# Altium project LM_HTR_001_Rev_C1.PrjPcb (part 2 of 2)

## Sheet HTR_Bridge2.SchDoc
size Tabloid
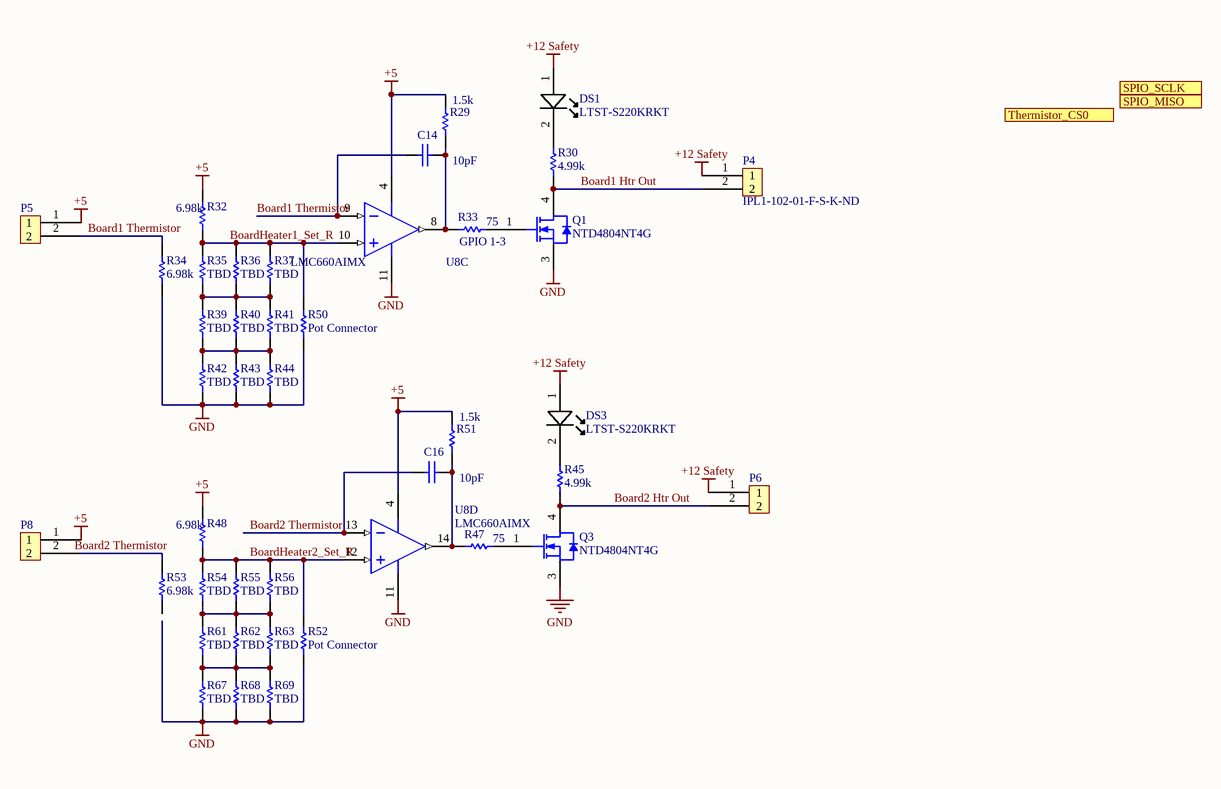
[diagram p3: HTR_Bridge2.SchDoc]

### Parts
(Parts that share a designator on the sheet are numbered #1, #2 ... from top to bottom, then left to right.)
C14#2  Capacitance: 10pF  [CAPC0805(2012)145_N]  (hidden comment: CAP CER 0.1UF 25V X7R 0805)
C16  Capacitance: 10pF  [CAPC0805(2012)145_N]  (hidden comment: CAP CER 0.1UF 25V X7R 0805)
DS1#2  Manufacturer Part Number: LTST-S220KRKT  [0805C_L]  (hidden comment: Visible Name Value Type    False Description Lite-On LTST-S220KRKT Red LED, 631 nm 2012 (0805) Side View, Rectangle Lens SMD package STRING)
DS3#2  Manufacturer Part Number: LTST-S220KRKT  [0805C_L]  (hidden comment: Visible Name Value Type    False Description Lite-On LTST-S220KRKT Red LED, 631 nm 2012 (0805) Side View, Rectangle Lens SMD package STRING)
P4#2  Supplier Part Number 1: IPL1-102-01-F-S-K-ND  [IPL1-102-01-F-S-K]  (hidden comment: IPL1-102-01-F-S-K)
P5#2  IPL1-102-01-F-S-K  [IPL1-102-01-F-S-K]  (value not drawn)
P6#2  IPL1-102-01-F-S-K  [IPL1-102-01-F-S-K]  (value not drawn)
P8#2  IPL1-102-01-F-S-K  [IPL1-102-01-F-S-K]  (value not drawn)
Q1#2  NTD4804NT4G  [ONSC-DPAK-3-369AA-01_V]
Q3#2  NTD4804NT4G  [ONSC-DPAK-3-369AA-01_V]
R29#2  1.5k  [RESC0805(2012)_N]
R30#2  Resistance (Ohms): 4.99k  [RESC0805(2012)_L]
R32#2  Resistance (Ohms): 6.98k  [RESC0805(2012)_N]  (hidden comment: 6K98 1% 0805(2012))
R33#2  Resistance (Ohms): 75  [RESC0805(2012)_L]
R34#2  Resistance (Ohms): 6.98k  [RESC0805(2012)_N]  (hidden comment: 6K98 1% 0805(2012))
R35#2  TBD  [RESC0805(2012)_N]
R36#2  TBD  [RESC0805(2012)_N]
R37#2  TBD  [RESC0805(2012)_N]
R39#2  TBD  [RESC0805(2012)_N]
R40#2  TBD  [RESC0805(2012)_N]
R41#2  TBD  [RESC0805(2012)_N]
R42#2  TBD  [RESC0805(2012)_N]
R43#2  TBD  [RESC0805(2012)_N]
R44#2  TBD  [RESC0805(2012)_N]
R45#2  Resistance (Ohms): 4.99k  [RESC0805(2012)_L]
R47#2  Resistance (Ohms): 75  [RESC0805(2012)_L]
R48#2  Resistance (Ohms): 6.98k  [RESC0805(2012)_N]  (hidden comment: 6K98 1% 0805(2012))
R50  Pot Connector  [AXIAL-0.3]
R51  1.5k  [RESC0805(2012)_N]
R52  Pot Connector  [AXIAL-0.3]
R53#2  Resistance (Ohms): 6.98k  [RESC0805(2012)_N]  (hidden comment: 6K98 1% 0805(2012))
R54#2  TBD  [RESC0805(2012)_N]
R55#2  TBD  [RESC0805(2012)_N]
R56#2  TBD  [RESC0805(2012)_N]
R61#2  TBD  [RESC0805(2012)_N]
R62#2  TBD  [RESC0805(2012)_N]
R63#2  TBD  [RESC0805(2012)_N]
R67#2  TBD  [RESC0805(2012)_N]
R68#2  TBD  [RESC0805(2012)_N]
R69#2  TBD  [RESC0805(2012)_N]
U8#1  LMC660AIMX  [D0014A_N]  (parts C,D of 4)

### Ports
SPIO_MISO, SPIO_SCLK, Thermistor_CS0

### Nets
+5: P5#2.1 P8#2.1 R29#2.2 R32#2.2 R48#2.2 R51.2 U8#1.4(V+)
+12 Safety: DS1#2.1(A) DS3#2.1(A) P4#2.1 P6#2.1
GND: Q1#2.3(S) Q3#2.3(S) R34#2.1 R42#2.1 R43#2.1 R44#2.1 R50.1 R52.1 R67#2.1 R68#2.1 R69#2.1 U8#1.11(V-)
Board1 Htr Out: P4#2.2 Q1#2.4(D) R30#2.2
Board1 Thermistor: C14#2.1 P5#2.2 R34#2.2 U8#1.9(IN3-)
Board2 Htr Out: P6#2.2 Q3#2.4(D) R45#2.2
Board2 Thermistor: C16.1 U8#1.13(IN4-)
BoardHeater1_Set_R: R32#2.1 R35#2.2 R36#2.2 R37#2.2 R50.2 U8#1.10(IN3+)
BoardHeater2_Set_R: R48#2.1 R52.2 R54#2.2 R55#2.2 R56#2.2 U8#1.12(IN4+)
NetC14#2_2: C14#2.2 R29#2.1 R33#2.1 U8#1.8(OUT3)
NetC16_2: C16.2 R47#2.1 R51.1 U8#1.14(OUT4)
NetDS1#2_2: DS1#2.2(K) R30#2.1
NetDS3#2_2: DS3#2.2(K) R45#2.1
NetP8#2_2: P8#2.2 R53#2.2
NetQ1#2_1: Q1#2.1(G) R33#2.2
NetQ3#2_1: Q3#2.1(G) R47#2.2
NetR35#2_1: R35#2.1 R36#2.1 R37#2.1 R39#2.2 R40#2.2 R41#2.2
NetR39#2_1: R39#2.1 R40#2.1 R41#2.1 R42#2.2 R43#2.2 R44#2.2
NetR54#2_1: R54#2.1 R55#2.1 R56#2.1 R61#2.2 R62#2.2 R63#2.2
NetR61#2_1: R61#2.1 R62#2.1 R63#2.1 R67#2.2 R68#2.2 R69#2.2

Not connected (* = marked no-connect by the designer): R53#2 1

### Notes on the sheet
- (near R33#2) GPIO 1-3
- Labels drawn without touching a wire or pin: Board2 Thermistor
- Title
- Size:
- Date:
- Tabloid
- Number:
- Time:
- Revision:
- Sheet
- of
- ZLS Corporation
- 7801 North Lamar Blvd.
- Suite E-184
- Austin, Texas 78752  USA
- (512) 453-0288
- File:

### Library data of the parts
C14#2 C16 = CMP-1036-04795-1: Manufacturer: Murata Electronics North America; Manufacturer Part Number: GRM21BR71E104KA01L; Tolerance: ±10%; Supplier 1: Digi-Key; Supplier Part Number 1: 490-1673-6-ND; RoHS: RoHS Compliant; Category: Capacitors; Stock 1: 891652; Pricing 1: 1=0.2, 10=0.145, 100=0.0683, 500=0.04788, 1000=0.03964 (USD); Packaging: Digi-Reel®; Part Status: Active; Voltage - Rated: 25V; Temperature Coefficient: X7R; Operating Temperature: -55°C ~ 125°C; Features: -; Ratings: -; Applications: General Purpose; Mounting Type: Surface Mount, MLCC; Package / Case: 0805 (2012 Metric); Size / Dimension: 0.079" L x 0.049" W (2.00mm x 1.25mm); Height - Seated (Max): -; Thickness (Max): 0.053" (1.35mm); Lead Spacing: -; Lead Style: -; ComponentLink1URL: http://www.murata.com/~/media/webrenewal/support/library/catalog/products/capacitor/mlcc/c02e.ashx; ComponentLink1Description: http://www.murata.com/~/media/webrenewal/support/library/catalog/products/capacitor/mlcc/c02e.ashx
DS1#2 DS3#2 = LED A/K: Manufacturer: Vishay / Lite-On; Lens Colour: Colorless; Lens Style: Diffused,Colorless; Viewing Angle: 130°; Luminous Intensity: 54mcd; Forward Current: 20mA; Forward Voltage: 2V; Power Rating: 75mW; Dominant Wavelength: 631nm; Lens Transparency: Clear; Number of Elements: 1; Wavelength: 639nm; Supplier 1: Digi-Key; Supplier Part Number 1: 160-1469-1-ND; Stock 1: 108191; Pricing 1: 1=0.31, 10=0.225, 25=0.1656, 100=0.1183, 250=0.0804, 500=0.071, 1000=0.0556 (USD); Mount: Surface Mount; Case/Package: 0805; Number of Pins: 2; Colour: Red; Case Code (Metric): 2012; Case Code (Imperial): 0805; Min Operating Temperature: -55°C; Max Operating Temperature: 85°C; Packaging: Tape and Reel; Package Quantity: 4000; Illumination Colour: Red; Test Current: 20mA; Power Dissipation: 75mW; Number of LEDs: 1; Length: 2.1mm; Height: 0.6mm; Width: 1mm; Depth: 0.6mm; Radiation Hardening: No; Lead Free: Lead Free; ComponentLink1URL: https://datasheet.ciiva.com/2110/s-110-ltst-s220krkt-2110132.pdf; ComponentLink1Description: https://datasheet.ciiva.com/2110/s-110-ltst-s220krkt-2110132.pdf; ComponentLink2URL: https://datasheet.ciiva.com/2110/s-110-ltst-s220krkt-2110133.pdf; ComponentLink2Description: https://datasheet.ciiva.com/2110/s-110-ltst-s220krkt-2110133.pdf; ComponentLink3URL: https://datasheet.ciiva.com/2110/s-110-ltst-s220krkt-2110134.pdf; ComponentLink3Description: https://datasheet.ciiva.com/2110/s-110-ltst-s220krkt-2110134.pdf; ComponentLink4URL: https://datasheet.ciiva.com/12403/lite-on-ltst-s220krkt-187389-12403798.pdf; ComponentLink4Description: https://datasheet.ciiva.com/12403/lite-on-ltst-s220krkt-187389-12403798.pdf; ComponentLink5URL: https://datasheet.ciiva.com/16345/lite-onltst-s220krkt-16345511.pdf; ComponentLink5Description: https://datasheet.ciiva.com/16345/lite-onltst-s220krkt-16345511.pdf; ComponentLink6URL: https://datasheet.ciiva.com/15118/getdatasheetpartid-225752-15118120.pdf; ComponentLink6Description: https://datasheet.ciiva.com/15118/getdatasheetpartid-225752-15118120.pdf; ComponentLink7URL: https://datasheet.ciiva.com/14633/0900766b80dc0b76-14633737.pdf; ComponentLink7Description: https://datasheet.ciiva.com/14633/0900766b80dc0b76-14633737.pdf; ComponentLink8URL: https://datasheet.ciiva.com/11775/0900766b80dc0b76-11775439.pdf; ComponentLink8Description: https://datasheet.ciiva.com/11775/0900766b80dc0b76-11775439.pdf
P4#2 P5#2 P6#2 P8#2 = IPL1-102-01-F-S-K: .100 TERMINAL ASSEMBLY; Manufacturer: Samtec Inc.; Connector Type: Header; Pitch - Mating: 0.100" (2.54mm); Number of Positions: 2; Number of Positions Loaded: All; Style: Board to Cable/Wire; Shrouding: Shrouded - 4 Wall; Contact Length - Mating: 0.215" (5.46mm); Contact Length - Post: 0.120" (3.05mm); Material Flammability Rating: UL94 V-0; Voltage Rating: 675VAC, 954VDC; Supplier 1: Digi-Key; Manufacturer Part Number: IPL1-102-01-F-S-K; RoHS: RoHS Compliant; Category: Connectors, Interconnects; Stock 1: 0; Pricing 1: 1=1.69 (USD); Packaging: Tube; Part Status: Active; Contact Type: Male Pin; Number of Rows: 1; Row Spacing - Mating: -; Mounting Type: Through Hole; Termination: Solder; Fastening Type: Locking Ramp; Overall Contact Length: -; Insulation Height: 0.320" (8.13mm); Contact Shape: Square; Contact Finish - Mating: Gold; Contact Finish Thickness - Mating: 3µin (0.08µm); Contact Finish - Post: Tin; Contact Material: Phosphor Bronze; Insulation Material: Liquid Crystal Polymer (LCP); Features: -; Operating Temperature: -55°C ~ 125°C; Ingress Protection: -; Insulation Color: Natural; Current Rating: -; Mated Stacking Heights: -; Contact Finish Thickness - Post: -; Applications: -; ComponentLink1URL: http://suddendocs.samtec.com/prints/ipl1-1xx-xx-xxx-s-xx-x-xx-mkt.pdf; ComponentLink1Description: http://suddendocs.samtec.com/prints/ipl1-1xx-xx-xxx-s-xx-x-xx-mkt.pdf
  P5#2 P6#2 P8#2: Supplier Part Number 1: IPL1-102-01-F-S-K-ND
Q1#2 Q3#2 = CMP-1058-00341-1: Power MOSFET, 30 V, 117 A, Single N-Channel, 3-Pin DPAK, Pb-Free, Tape and Reel; Manufacturer: On Semiconductor; Coss Typ (pF): 952; Qrr Typ (nC): 30; VGS Max (V): 20; ID Max (A): 117; Crss Typ (pF): 556; Channel Polarity: N Channel; Ciss Typ (pF): 4490; VGS(th) Max (V): 2.5; ComponentLink2Description: Datasheet; ComponentLink3Description: Package Specification; Mounting Technology: Surface Mount; PackageDescription: 3-Pin Flange Mount, Body 6.54 x 6.095 mm, Pitch 2.29 mm; PackageVersion: Rev. B, 06/2010; PartNumber: NTD4804NT4G; ComponentLink2URL: http://www.onsemi.cn/pub_link/Collateral/NTD4804N-D.PDF; RoHS: Pb-Free; Configuration: Single; DatasheetVersion: Rev. 8; PackageReference: DPAK-3-369AA-01; ComponentLink3URL: http://www.onsemi.cn/pub_link/Collateral/369AA.PDF; ComponentLink1Description: Manufacturer URL; Packing: Tape and Reel; Package Type: DPAK-3; ComponentLink1URL: http://www.onsemi.com/; V(BR)DSS Min (V): 30; Supplier 1: Digi-Key; Supplier Part Number 1: NTD4804NT4GOSDKR-ND
R29#2 R51 = CMP-1013-00606-1: 6K98 0.125W 1% 0805 (2012 Metric)  SMD
R30#2 R45#2 = CMP-1013-00393-1: Manufacturer: Vishay Dale; Manufacturer Part Number: CRCW08054K99FKEA; Tolerance: ±1%; Power (Watts): 0.125W, 1/8W; Temperature Coefficient: ±100ppm/°C; Supplier 1: Digi-Key; Supplier Part Number 1: 541-4.99KCCT-ND; RoHS: RoHS Compliant; Category: Resistors; Stock 1: 93740; Pricing 1: 1=0.1, 10=0.044, 100=0.0178, 1000=0.00802, 2500=0.00696 (USD); Packaging: Cut Tape (CT); Part Status: Active; Composition: Thick Film; Features: Automotive AEC-Q200; Operating Temperature: -55°C ~ 155°C; Package / Case: 0805 (2012 Metric); Supplier Device Package: 0805; Size / Dimension: 0.079" L x 0.049" W (2.00mm x 1.25mm); Height - Seated (Max): 0.020" (0.50mm); Failure Rate: -; ComponentLink1URL: http://www.vishay.com/docs/20035/dcrcwe3.pdf; ComponentLink1Description: http://www.vishay.com/docs/20035/dcrcwe3.pdf
R32#2 R34#2 R48#2 R53#2 = CMP-1013-00606-1: 6K98 0.125W 1% 0805 (2012 Metric)  SMD; Manufacturer: Vishay Dale; Manufacturer Part Number: CRCW08056K98FKEA; Power (Watts): 0.125W, 1/8W; Temperature Coefficient: ±100ppm/°C; Supplier 1: Digi-Key; Supplier Part Number 1: 541-6.98KCCT-ND; RoHS: RoHS Compliant; Category: Resistors; Stock 1: 34245; Pricing 1: 1=0.1, 10=0.044, 100=0.0178, 1000=0.00802, 2500=0.00696 (USD); Packaging: Cut Tape (CT); Part Status: Active; Tolerance: ±1%; Composition: Thick Film; Features: Automotive AEC-Q200; Operating Temperature: -55°C ~ 155°C; Package / Case: 0805 (2012 Metric); Supplier Device Package: 0805; Size / Dimension: 0.079" L x 0.049" W (2.00mm x 1.25mm); Height - Seated (Max): 0.020" (0.50mm); Failure Rate: -; ComponentLink1URL: http://www.vishay.com/docs/20035/dcrcwe3.pdf; ComponentLink1Description: http://www.vishay.com/docs/20035/dcrcwe3.pdf
R33#2 R47#2 = CMP-1013-00393-1: Manufacturer: Vishay Dale; Manufacturer Part Number: CRCW080575R0FKEA; Tolerance: ±1%; Power (Watts): 0.125W, 1/8W; Temperature Coefficient: ±100ppm/°C; Supplier 1: Digi-Key; Supplier Part Number 1: 541-75.0CCT-ND; RoHS: RoHS Compliant; Category: Resistors; Stock 1: 32546; Pricing 1: 1=0.1, 10=0.044, 100=0.0178, 1000=0.00802, 2500=0.00696 (USD); Packaging: Cut Tape (CT); Part Status: Active; Composition: Thick Film; Features: Automotive AEC-Q200; Operating Temperature: -55°C ~ 155°C; Package / Case: 0805 (2012 Metric); Supplier Device Package: 0805; Size / Dimension: 0.079" L x 0.049" W (2.00mm x 1.25mm); Height - Seated (Max): 0.020" (0.50mm); Failure Rate: -; ComponentLink1URL: http://www.vishay.com/docs/20035/dcrcwe3.pdf; ComponentLink1Description: http://www.vishay.com/docs/20035/dcrcwe3.pdf
R35#2 R36#2 R37#2 R39#2 R40#2 R41#2 R42#2 R43#2 R44#2 R54#2 R55#2 R56#2 R61#2 R62#2 R63#2 R67#2 R68#2 R69#2 = CMP-1013-00606-1: 6K98 0.125W 1% 0805 (2012 Metric)  SMD; Manufacturer: Vishay Dale; Power (Watts): 0.125W, 1/8W; Temperature Coefficient: ±100ppm/°C; Supplier 1: Digi-Key; RoHS: RoHS Compliant; Category: Resistors; Stock 1: 34245; Pricing 1: 1=0.1, 10=0.044, 100=0.0178, 1000=0.00802, 2500=0.00696 (USD); Packaging: Cut Tape (CT); Part Status: Active; Resistance (Ohms): TBD; Tolerance: ±1%; Composition: Thick Film; Features: Automotive AEC-Q200; Operating Temperature: -55°C ~ 155°C; Package / Case: 0805 (2012 Metric); Supplier Device Package: 0805; Size / Dimension: 0.079" L x 0.049" W (2.00mm x 1.25mm); Height - Seated (Max): 0.020" (0.50mm); Failure Rate: -; ComponentLink1URL: http://www.vishay.com/docs/20035/dcrcwe3.pdf; ComponentLink1Description: http://www.vishay.com/docs/20035/dcrcwe3.pdf
R50 R52 = Res1: Resistor
U8#1 = CMP-0055-00899-3: CMOS Quad Operational Amplifier, 14-pin Narrow SOIC; Manufacturer: Texas Instruments; PackageTopMarking: NSUZXYTTE#*LMC660AIM; PowerWise: N; CompType: Amplifiers; RoHS: N; Code_JEDEC: MS-012AB; ComponentLink1Description: Datasheet URL; ComponentLink1URL: http://www.ti.com/general/docs/lit/getliterature.tsp?genericPartNumber=LMC660&fileType=pdf; Code_IPC: SOIC127P600-14; PackageDescription: Molded Package S.O., .150in Wide, 14 Lead; Package Reference: D0014A; PinCount: 14; PartId: 1

## Sheet HTR_Bridge3.SchDoc
size Tabloid
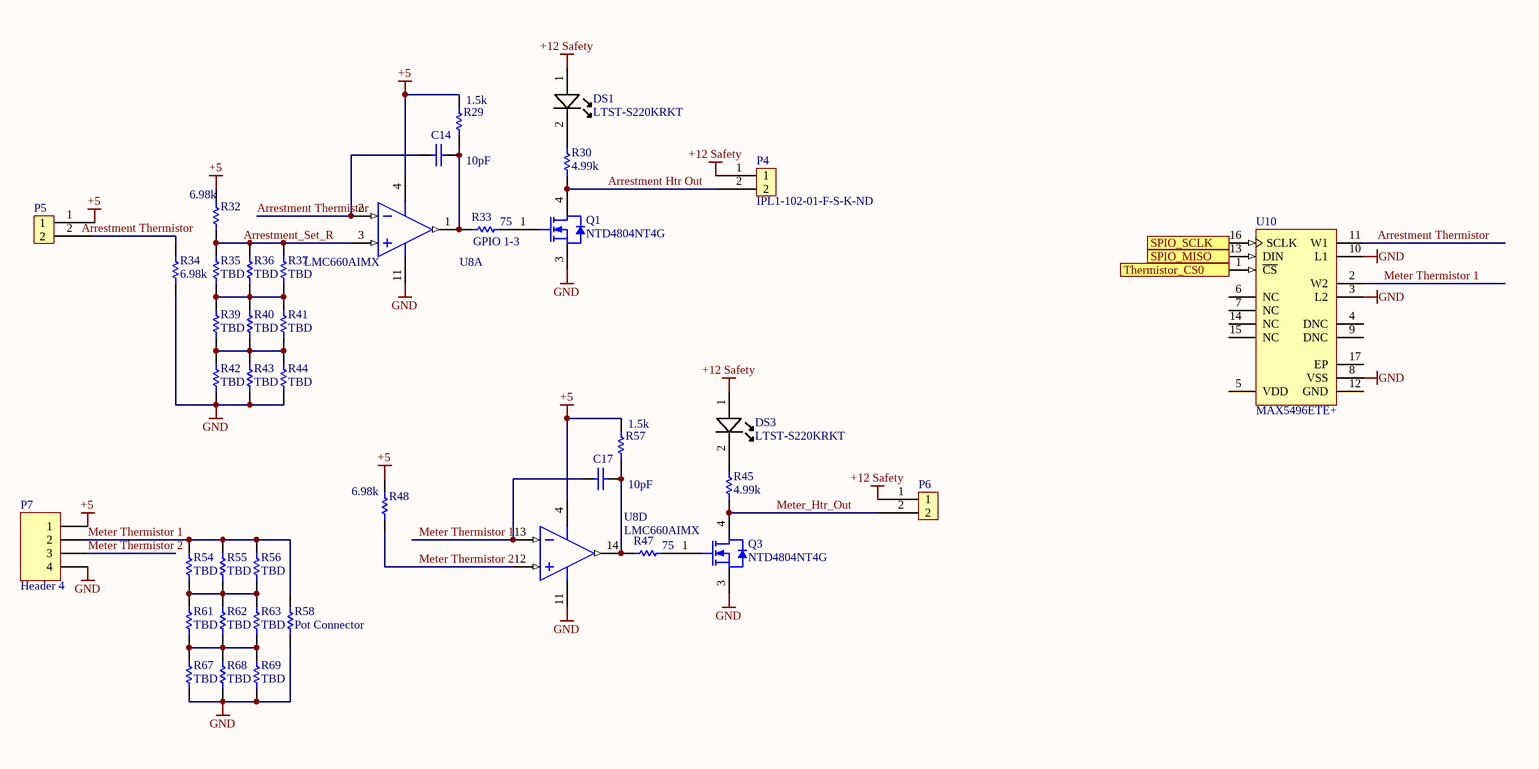
[diagram p4: HTR_Bridge3.SchDoc]

### Parts
(Parts that share a designator on the sheet are numbered #1, #2 ... from top to bottom, then left to right.)
C14#3  Capacitance: 10pF  [CAPC0805(2012)145_N]  (hidden comment: CAP CER 0.1UF 25V X7R 0805)
C17  Capacitance: 10pF  [CAPC0805(2012)145_N]  (hidden comment: CAP CER 0.1UF 25V X7R 0805)
DS1#3  Manufacturer Part Number: LTST-S220KRKT  [0805C_L]  (hidden comment: Visible Name Value Type    False Description Lite-On LTST-S220KRKT Red LED, 631 nm 2012 (0805) Side View, Rectangle Lens SMD package STRING)
DS3#3  Manufacturer Part Number: LTST-S220KRKT  [0805C_L]  (hidden comment: Visible Name Value Type    False Description Lite-On LTST-S220KRKT Red LED, 631 nm 2012 (0805) Side View, Rectangle Lens SMD package STRING)
P4#3  Supplier Part Number 1: IPL1-102-01-F-S-K-ND  [IPL1-102-01-F-S-K]  (hidden comment: IPL1-102-01-F-S-K)
P5#3  IPL1-102-01-F-S-K  [IPL1-102-01-F-S-K]  (value not drawn)
P6#3  IPL1-102-01-F-S-K  [IPL1-102-01-F-S-K]  (value not drawn)
P7  Header 4  [IPL1-104-01-L-S-K]
Q1#3  NTD4804NT4G  [ONSC-DPAK-3-369AA-01_V]
Q3#3  NTD4804NT4G  [ONSC-DPAK-3-369AA-01_V]
R29#3  1.5k  [RESC0805(2012)_N]
R30#3  Resistance (Ohms): 4.99k  [RESC0805(2012)_L]
R32#3  Resistance (Ohms): 6.98k  [RESC0805(2012)_N]  (hidden comment: 6K98 1% 0805(2012))
R33#3  Resistance (Ohms): 75  [RESC0805(2012)_L]
R34#3  Resistance (Ohms): 6.98k  [RESC0805(2012)_N]  (hidden comment: 6K98 1% 0805(2012))
R35#3  TBD  [RESC0805(2012)_N]
R36#3  TBD  [RESC0805(2012)_N]
R37#3  TBD  [RESC0805(2012)_N]
R39#3  TBD  [RESC0805(2012)_N]
R40#3  TBD  [RESC0805(2012)_N]
R41#3  TBD  [RESC0805(2012)_N]
R42#3  TBD  [RESC0805(2012)_N]
R43#3  TBD  [RESC0805(2012)_N]
R44#3  TBD  [RESC0805(2012)_N]
R45#3  Resistance (Ohms): 4.99k  [RESC0805(2012)_L]
R47#3  Resistance (Ohms): 75  [RESC0805(2012)_L]
R48#3  Resistance (Ohms): 6.98k  [RESC0805(2012)_N]  (hidden comment: 6K98 1% 0805(2012))
R54#3  TBD  [RESC0805(2012)_N]
R55#3  TBD  [RESC0805(2012)_N]
R56#3  TBD  [RESC0805(2012)_N]
R57  1.5k  [RESC0805(2012)_N]
R58  Pot Connector  [AXIAL-0.3]
R61#3  TBD  [RESC0805(2012)_N]
R62#3  TBD  [RESC0805(2012)_N]
R63#3  TBD  [RESC0805(2012)_N]
R67#3  TBD  [RESC0805(2012)_N]
R68#3  TBD  [RESC0805(2012)_N]
R69#3  TBD  [RESC0805(2012)_N]
U8#2  LMC660AIMX  [D0014A_N]  (parts A,D of 4)
U10  MAX5496ETE+  [MAXM-T1655+3_M]

### Ports
SPIO_MISO, SPIO_SCLK, Thermistor_CS0

### Nets
+5: P5#3.1 P7.1 R29#3.2 R32#3.2 R48#3.2 R57.2 U8#2.4(V+)
+12 Safety: DS1#3.1(A) DS3#3.1(A) P4#3.1 P6#3.1
GND: P7.4 Q1#3.3(S) Q3#3.3(S) R34#3.1 R42#3.1 R43#3.1 R44#3.1 R58.1 R67#3.1 R68#3.1 R69#3.1 U8#2.11(V-) U10.3(L2) U10.8(VSS) U10.10(L1)
Arrestment Htr Out: P4#3.2 Q1#3.4(D) R30#3.2
Arrestment Thermistor: C14#3.1 U8#2.2(IN1-) U10.11(W1)
Arrestment_Set_R: R32#3.1 R35#3.2 R36#3.2 R37#3.2 U8#2.3(IN1+)
Meter Thermistor 1: C17.1 P7.2 R54#3.2 R55#3.2 R56#3.2 R58.2 U8#2.13(IN4-) U10.2(W2)
Meter Thermistor 2: P7.3 R48#3.1 U8#2.12(IN4+)
Meter_Htr_Out: P6#3.2 Q3#3.4(D) R45#3.2
SPI0_MISO: U10.13(DIN) ; port SPIO_MISO
SPI0_SCLK: U10.16(SCLK) ; port SPIO_SCLK
Thermistor_CS0: U10.1(~{CS}) ; port Thermistor_CS0
NetC14#3_2: C14#3.2 R29#3.1 R33#3.1 U8#2.1(OUT1)
NetC17_2: C17.2 R47#3.1 R57.1 U8#2.14(OUT4)
NetDS1#3_2: DS1#3.2(K) R30#3.1
NetDS3#3_2: DS3#3.2(K) R45#3.1
NetP5#3_2: P5#3.2 R34#3.2
NetQ1#3_1: Q1#3.1(G) R33#3.2
NetQ3#3_1: Q3#3.1(G) R47#3.2
NetR35#3_1: R35#3.1 R36#3.1 R37#3.1 R39#3.2 R40#3.2 R41#3.2
NetR39#3_1: R39#3.1 R40#3.1 R41#3.1 R42#3.2 R43#3.2 R44#3.2
NetR54#3_1: R54#3.1 R55#3.1 R56#3.1 R61#3.2 R62#3.2 R63#3.2
NetR61#3_1: R61#3.1 R62#3.1 R63#3.1 R67#3.2 R68#3.2 R69#3.2

Not connected (* = marked no-connect by the designer): U10 4(DNC) 5(VDD) 6(NC) 7(NC) 9(DNC) 12(GND) 14(NC) 15(NC) 17(EP)

### Notes on the sheet
- (near R33#3) GPIO 1-3
- Labels drawn without touching a wire or pin: Arrestment Thermistor
- Title
- Size:
- Date:
- Tabloid
- Number:
- Time:
- Revision:
- Sheet
- of
- ZLS Corporation
- 7801 North Lamar Blvd.
- Suite E-184
- Austin, Texas 78752  USA
- (512) 453-0288
- File:

### Library data of the parts
C14#3 C17 = CMP-1036-04795-1: as C14#2 on sheet HTR_Bridge2; Supplier 1: Digi-Key; Supplier Part Number 1: 490-1673-6-ND; RoHS: RoHS Compliant; Category: Capacitors; Stock 1: 891652; Pricing 1: 1=0.2, 10=0.145, 100=0.0683, 500=0.04788, 1000=0.03964 (USD); Packaging: Digi-Reel®; Part Status: Active; Voltage - Rated: 25V; Temperature Coefficient: X7R; Operating Temperature: -55°C ~ 125°C; Features: -; Ratings: -; Applications: General Purpose; Mounting Type: Surface Mount, MLCC; Package / Case: 0805 (2012 Metric); Size / Dimension: 0.079" L x 0.049" W (2.00mm x 1.25mm); Height - Seated (Max): -; Thickness (Max): 0.053" (1.35mm); Lead Spacing: -; Lead Style: -; ComponentLink1URL: http://www.murata.com/~/media/webrenewal/support/library/catalog/products/capacitor/mlcc/c02e.ashx; ComponentLink1Description: http://www.murata.com/~/media/webrenewal/support/library/catalog/products/capacitor/mlcc/c02e.ashx
DS1#3 DS3#3 = LED A/K: as DS1#2 on sheet HTR_Bridge2; Supplier 1: Digi-Key; Supplier Part Number 1: 160-1469-1-ND; Stock 1: 108191; Pricing 1: 1=0.31, 10=0.225, 25=0.1656, 100=0.1183, 250=0.0804, 500=0.071, 1000=0.0556 (USD); Mount: Surface Mount; Case/Package: 0805; Number of Pins: 2; Colour: Red; Case Code (Metric): 2012; Case Code (Imperial): 0805; Min Operating Temperature: -55°C; Max Operating Temperature: 85°C; Packaging: Tape and Reel; Package Quantity: 4000; Illumination Colour: Red; Test Current: 20mA; Power Dissipation: 75mW; Number of LEDs: 1; Length: 2.1mm; Height: 0.6mm; Width: 1mm; Depth: 0.6mm; Radiation Hardening: No; Lead Free: Lead Free; ComponentLink1URL: https://datasheet.ciiva.com/2110/s-110-ltst-s220krkt-2110132.pdf; ComponentLink1Description: https://datasheet.ciiva.com/2110/s-110-ltst-s220krkt-2110132.pdf; ComponentLink2URL: https://datasheet.ciiva.com/2110/s-110-ltst-s220krkt-2110133.pdf; ComponentLink2Description: https://datasheet.ciiva.com/2110/s-110-ltst-s220krkt-2110133.pdf; ComponentLink3URL: https://datasheet.ciiva.com/2110/s-110-ltst-s220krkt-2110134.pdf; ComponentLink3Description: https://datasheet.ciiva.com/2110/s-110-ltst-s220krkt-2110134.pdf; ComponentLink4URL: https://datasheet.ciiva.com/12403/lite-on-ltst-s220krkt-187389-12403798.pdf; ComponentLink4Description: https://datasheet.ciiva.com/12403/lite-on-ltst-s220krkt-187389-12403798.pdf; ComponentLink5URL: https://datasheet.ciiva.com/16345/lite-onltst-s220krkt-16345511.pdf; ComponentLink5Description: https://datasheet.ciiva.com/16345/lite-onltst-s220krkt-16345511.pdf; ComponentLink6URL: https://datasheet.ciiva.com/15118/getdatasheetpartid-225752-15118120.pdf; ComponentLink6Description: https://datasheet.ciiva.com/15118/getdatasheetpartid-225752-15118120.pdf; ComponentLink7URL: https://datasheet.ciiva.com/14633/0900766b80dc0b76-14633737.pdf; ComponentLink7Description: https://datasheet.ciiva.com/14633/0900766b80dc0b76-14633737.pdf; ComponentLink8URL: https://datasheet.ciiva.com/11775/0900766b80dc0b76-11775439.pdf; ComponentLink8Description: https://datasheet.ciiva.com/11775/0900766b80dc0b76-11775439.pdf
P4#3 P5#3 P6#3 = IPL1-102-01-F-S-K: as P4#2 on sheet HTR_Bridge2; Supplier 1: Digi-Key; Manufacturer Part Number: IPL1-102-01-F-S-K; RoHS: RoHS Compliant; Category: Connectors, Interconnects; Stock 1: 0; Pricing 1: 1=1.69 (USD); Packaging: Tube; Part Status: Active; Contact Type: Male Pin; Number of Rows: 1; Row Spacing - Mating: -; Mounting Type: Through Hole; Termination: Solder; Fastening Type: Locking Ramp; Overall Contact Length: -; Insulation Height: 0.320" (8.13mm); Contact Shape: Square; Contact Finish - Mating: Gold; Contact Finish Thickness - Mating: 3µin (0.08µm); Contact Finish - Post: Tin; Contact Material: Phosphor Bronze; Insulation Material: Liquid Crystal Polymer (LCP); Features: -; Operating Temperature: -55°C ~ 125°C; Ingress Protection: -; Insulation Color: Natural; Current Rating: -; Mated Stacking Heights: -; Contact Finish Thickness - Post: -; Applications: -; ComponentLink1URL: http://suddendocs.samtec.com/prints/ipl1-1xx-xx-xxx-s-xx-x-xx-mkt.pdf; ComponentLink1Description: http://suddendocs.samtec.com/prints/ipl1-1xx-xx-xxx-s-xx-x-xx-mkt.pdf
  P5#3 P6#3: Supplier Part Number 1: IPL1-102-01-F-S-K-ND
P7 = Header 4: Header, 4-Pin; LatestRevisionDate: 17-Jul-2002; LatestRevisionNote: Re-released for DXP Platform.; Publisher: Altium Limited
Q1#3 Q3#3 = CMP-1058-00341-1: as Q1#2 on sheet HTR_Bridge2; ComponentLink2Description: Datasheet; ComponentLink3Description: Package Specification; Mounting Technology: Surface Mount; PackageDescription: 3-Pin Flange Mount, Body 6.54 x 6.095 mm, Pitch 2.29 mm; PackageVersion: Rev. B, 06/2010; PartNumber: NTD4804NT4G; ComponentLink2URL: http://www.onsemi.cn/pub_link/Collateral/NTD4804N-D.PDF; RoHS: Pb-Free; Configuration: Single; DatasheetVersion: Rev. 8; PackageReference: DPAK-3-369AA-01; ComponentLink3URL: http://www.onsemi.cn/pub_link/Collateral/369AA.PDF; ComponentLink1Description: Manufacturer URL; Packing: Tape and Reel; Package Type: DPAK-3; ComponentLink1URL: http://www.onsemi.com/; V(BR)DSS Min (V): 30; Supplier 1: Digi-Key; Supplier Part Number 1: NTD4804NT4GOSDKR-ND
R29#3 R57 = CMP-1013-00606-1: 6K98 0.125W 1% 0805 (2012 Metric)  SMD
R30#3 R45#3 = CMP-1013-00393-1: as R30#2 on sheet HTR_Bridge2; Supplier 1: Digi-Key; Supplier Part Number 1: 541-4.99KCCT-ND; RoHS: RoHS Compliant; Category: Resistors; Stock 1: 93740; Pricing 1: 1=0.1, 10=0.044, 100=0.0178, 1000=0.00802, 2500=0.00696 (USD); Packaging: Cut Tape (CT); Part Status: Active; Composition: Thick Film; Features: Automotive AEC-Q200; Operating Temperature: -55°C ~ 155°C; Package / Case: 0805 (2012 Metric); Supplier Device Package: 0805; Size / Dimension: 0.079" L x 0.049" W (2.00mm x 1.25mm); Height - Seated (Max): 0.020" (0.50mm); Failure Rate: -; ComponentLink1URL: http://www.vishay.com/docs/20035/dcrcwe3.pdf; ComponentLink1Description: http://www.vishay.com/docs/20035/dcrcwe3.pdf
R32#3 R34#3 R48#3 = CMP-1013-00606-1: as R32#2 on sheet HTR_Bridge2; Supplier 1: Digi-Key; Supplier Part Number 1: 541-6.98KCCT-ND; RoHS: RoHS Compliant; Category: Resistors; Stock 1: 34245; Pricing 1: 1=0.1, 10=0.044, 100=0.0178, 1000=0.00802, 2500=0.00696 (USD); Packaging: Cut Tape (CT); Part Status: Active; Tolerance: ±1%; Composition: Thick Film; Features: Automotive AEC-Q200; Operating Temperature: -55°C ~ 155°C; Package / Case: 0805 (2012 Metric); Supplier Device Package: 0805; Size / Dimension: 0.079" L x 0.049" W (2.00mm x 1.25mm); Height - Seated (Max): 0.020" (0.50mm); Failure Rate: -; ComponentLink1URL: http://www.vishay.com/docs/20035/dcrcwe3.pdf; ComponentLink1Description: http://www.vishay.com/docs/20035/dcrcwe3.pdf
R33#3 R47#3 = CMP-1013-00393-1: as R33#2 on sheet HTR_Bridge2; Supplier 1: Digi-Key; Supplier Part Number 1: 541-75.0CCT-ND; RoHS: RoHS Compliant; Category: Resistors; Stock 1: 32546; Pricing 1: 1=0.1, 10=0.044, 100=0.0178, 1000=0.00802, 2500=0.00696 (USD); Packaging: Cut Tape (CT); Part Status: Active; Composition: Thick Film; Features: Automotive AEC-Q200; Operating Temperature: -55°C ~ 155°C; Package / Case: 0805 (2012 Metric); Supplier Device Package: 0805; Size / Dimension: 0.079" L x 0.049" W (2.00mm x 1.25mm); Height - Seated (Max): 0.020" (0.50mm); Failure Rate: -; ComponentLink1URL: http://www.vishay.com/docs/20035/dcrcwe3.pdf; ComponentLink1Description: http://www.vishay.com/docs/20035/dcrcwe3.pdf
R35#3 R36#3 R37#3 R39#3 R40#3 R41#3 R42#3 R43#3 R44#3 R54#3 R55#3 R56#3 R61#3 R62#3 R63#3 R67#3 R68#3 R69#3 = CMP-1013-00606-1: as R35#2 on sheet HTR_Bridge2; Supplier 1: Digi-Key; RoHS: RoHS Compliant; Category: Resistors; Stock 1: 34245; Pricing 1: 1=0.1, 10=0.044, 100=0.0178, 1000=0.00802, 2500=0.00696 (USD); Packaging: Cut Tape (CT); Part Status: Active; Resistance (Ohms): TBD; Tolerance: ±1%; Composition: Thick Film; Features: Automotive AEC-Q200; Operating Temperature: -55°C ~ 155°C; Package / Case: 0805 (2012 Metric); Supplier Device Package: 0805; Size / Dimension: 0.079" L x 0.049" W (2.00mm x 1.25mm); Height - Seated (Max): 0.020" (0.50mm); Failure Rate: -; ComponentLink1URL: http://www.vishay.com/docs/20035/dcrcwe3.pdf; ComponentLink1Description: http://www.vishay.com/docs/20035/dcrcwe3.pdf
R58 = Res1: Resistor
U8#2 = CMP-0055-00899-3: as U8#1 on sheet HTR_Bridge2; RoHS: N; Code_JEDEC: MS-012AB; ComponentLink1Description: Datasheet URL; ComponentLink1URL: http://www.ti.com/general/docs/lit/getliterature.tsp?genericPartNumber=LMC660&fileType=pdf; Code_IPC: SOIC127P600-14; PackageDescription: Molded Package S.O., .150in Wide, 14 Lead; Package Reference: D0014A; PinCount: 14; PartId: 1
U10 = CMP-0023-00245-1: Dual 10k Digital Potentiometer (Voltage Divider) with 3-Wire Serial SPI Control Interface, Non-Volatile, Linear Taper, 1024 Steps, -40 to 85 degC, 16-pin TQFN (T1655+3), Pb-Free; PackageVersion: Rev. Q, 09/2011; Control Interface: 3-Wire Serial SPI; Code_JEDEC: MO220; Features: EEPROM Wiper Memory; ComponentLink1URL: http://www.maximintegrated.com/; DatasheetVersion: Rev. 2; ComponentLink1Description: Manufacturer URL; PartNumber: MAX5496ETE+; ComponentLink2Description: Datasheet; ComponentLink3Description: Package Specification; Applications: Fiber Communications, Power Supply Cal.; ComponentLink3URL: http://pdfserv.maximintegrated.com/package_dwgs/21-0140.PDF; ComponentLink2URL: http://datasheets.maximintegrated.com/en/ds/MAX5494-MAX5499.pdf; Mounting Technology: Surface Mount; PackageReference: T1655+3; PackageDescription: 16-Pin Thin Quad Flatpack, No Leads, Body 5 x 5 mm, Pitch 0.8 mm

## Nets that join several sheets
+3.3: LM_HTR_001 (C5.1 P2.20 U3.3), HTR_Bridge1 (U9.5)
+5: LM_HTR_001 (8 pins), Signal_Conditioner (6 pins), HTR_Bridge1 (8 pins), HTR_Bridge2 (7 pins), HTR_Bridge3 (7 pins)
+12: LM_HTR_001 (P2.21 P2.22), HTR_Bridge1 (P3.1)
+12 Safety: HTR_Bridge1 (5 pins), HTR_Bridge2 (DS1#2.1 DS3#2.1 P4#2.1 P6#2.1), HTR_Bridge3 (DS1#3.1 DS3#3.1 P4#3.1 P6#3.1)
-5: LM_HTR_001 (P2.3), Signal_Conditioner (U4.4 U6.4)
GND: LM_HTR_001 (15 pins), Signal_Conditioner (8 pins), HTR_Bridge1 (18 pins), HTR_Bridge2 (12 pins), HTR_Bridge3 (15 pins)
CROSS NEUTRAL: LM_HTR_001 (P1.3), Signal_Conditioner (U7.25)
Cross_Blue: LM_HTR_001 (P1.5), Signal_Conditioner (U7.24)
Cross_Yellow: LM_HTR_001 (P1.1), Signal_Conditioner (C10.2 U7.27)
LONG NEUTRAL: LM_HTR_001 (P1.4), Signal_Conditioner (U5.25)
Long_Blue: LM_HTR_001 (P1.6), Signal_Conditioner (U5.24)
Long_Yellow: LM_HTR_001 (P1.2), Signal_Conditioner (C6.2 U5.27)
NetTP2_1: LM_HTR_001 (U2.10), Signal_Conditioner (TP2.1 U4.1 U4.2)
NetTP6_1: LM_HTR_001 (U2.11), Signal_Conditioner (TP6.1 U6.1 U6.2)
SPI0_MISO: LM_HTR_001 (P2.9 U3.1), HTR_Bridge1 (U9.13), HTR_Bridge3 (U10.13)
SPI0_SCLK: LM_HTR_001 (P2.10 U3.10), HTR_Bridge1 (U9.16), HTR_Bridge3 (U10.16)
Thermistor_CS0: LM_HTR_001 (P2.12 U3.9), HTR_Bridge1 (U9.1), HTR_Bridge3 (U10.1)